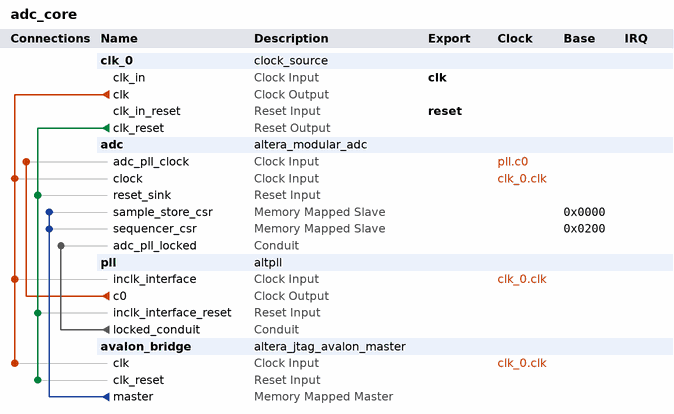
[diagram p0: system contents]
# Platform Designer (Qsys) system adc_core, MAX 10 10M08SAU169C8G
# Parameters at their usual value, and those the tool derives, are not listed.
package require -exact qsys 18.1
create_system adc_core
set_project_property DEVICE_FAMILY {MAX 10}
set_project_property DEVICE 10M08SAU169C8G

add_instance clk_0 clock_source 18.1
set_instance_parameter_value clk_0 clockFrequency 12000000

add_instance adc altera_modular_adc 18.1
set_instance_parameter_value adc CLOCK_FREQ 12000000
set_instance_parameter_value adc CORE_VAR 0
set_instance_parameter_value adc DEVICE_PART 10M08SAU169C8G
set_instance_parameter_value adc ENABLE_DEBUG 1
set_instance_parameter_value adc clkdiv 2
set_instance_parameter_value adc int_vref_vr 3.3
set_instance_parameter_value adc refsel 1
set_instance_parameter_value adc sample_rate 0
set_instance_parameter_value adc seq_order_length 1
set_instance_parameter_value adc seq_order_slot_1 0
set_instance_parameter_value adc seq_order_slot_2 30
set_instance_parameter_value adc seq_order_slot_3 30
set_instance_parameter_value adc seq_order_slot_4 30
set_instance_parameter_value adc seq_order_slot_5 30
set_instance_parameter_value adc seq_order_slot_6 30
set_instance_parameter_value adc seq_order_slot_7 30
set_instance_parameter_value adc use_ch0 true
set_instance_parameter_value adc use_ch1 false
set_instance_parameter_value adc use_ch2 false
set_instance_parameter_value adc use_ch3 false
set_instance_parameter_value adc use_ch4 false
set_instance_parameter_value adc use_ch5 false
set_instance_parameter_value adc use_ch6 false
set_instance_parameter_value adc use_ch7 false
set_instance_parameter_value adc use_ch8 false
set_instance_parameter_value adc use_tsd false

add_instance pll altpll 18.1
set_instance_parameter_value pll CLK0_DIVIDE_BY 6
set_instance_parameter_value pll CLK0_MULTIPLY_BY 5
set_instance_parameter_value pll INCLK0_INPUT_FREQUENCY 83333
set_instance_parameter_value pll PORT_ARESET PORT_USED
set_instance_parameter_value pll PORT_LOCKED PORT_USED
set_instance_parameter_value pll PORT_clk1 PORT_UNUSED
set_instance_parameter_value pll PORT_clk2 PORT_UNUSED
set_instance_parameter_value pll PORT_clk3 PORT_UNUSED

add_instance avalon_bridge altera_jtag_avalon_master 18.1

# connections
add_connection clk_0.clk adc.clock clock
add_connection clk_0.clk avalon_bridge.clk clock
add_connection clk_0.clk pll.inclk_interface clock
add_connection pll.c0 adc.adc_pll_clock clock
add_connection clk_0.clk_reset adc.reset_sink reset
add_connection clk_0.clk_reset avalon_bridge.clk_reset reset
add_connection clk_0.clk_reset pll.inclk_interface_reset reset
add_connection avalon_bridge.master adc.sample_store_csr avalon
set_connection_parameter_value avalon_bridge.master/adc.sample_store_csr baseAddress 0x0000
add_connection avalon_bridge.master adc.sequencer_csr avalon
set_connection_parameter_value avalon_bridge.master/adc.sequencer_csr baseAddress 0x0200
add_connection pll.locked_conduit adc.adc_pll_locked conduit

# exported interfaces
add_interface clk clock sink
set_interface_property clk EXPORT_OF clk_0.clk_in
add_interface reset reset sink
set_interface_property reset EXPORT_OF clk_0.clk_in_reset

set_interconnect_requirement {$system} qsys_mm.clockCrossingAdapter HANDSHAKE
set_interconnect_requirement {$system} qsys_mm.enableEccProtection FALSE
set_interconnect_requirement {$system} qsys_mm.insertDefaultSlave FALSE
set_interconnect_requirement {$system} qsys_mm.maxAdditionalLatency 1

save_system adc_core.qsys
